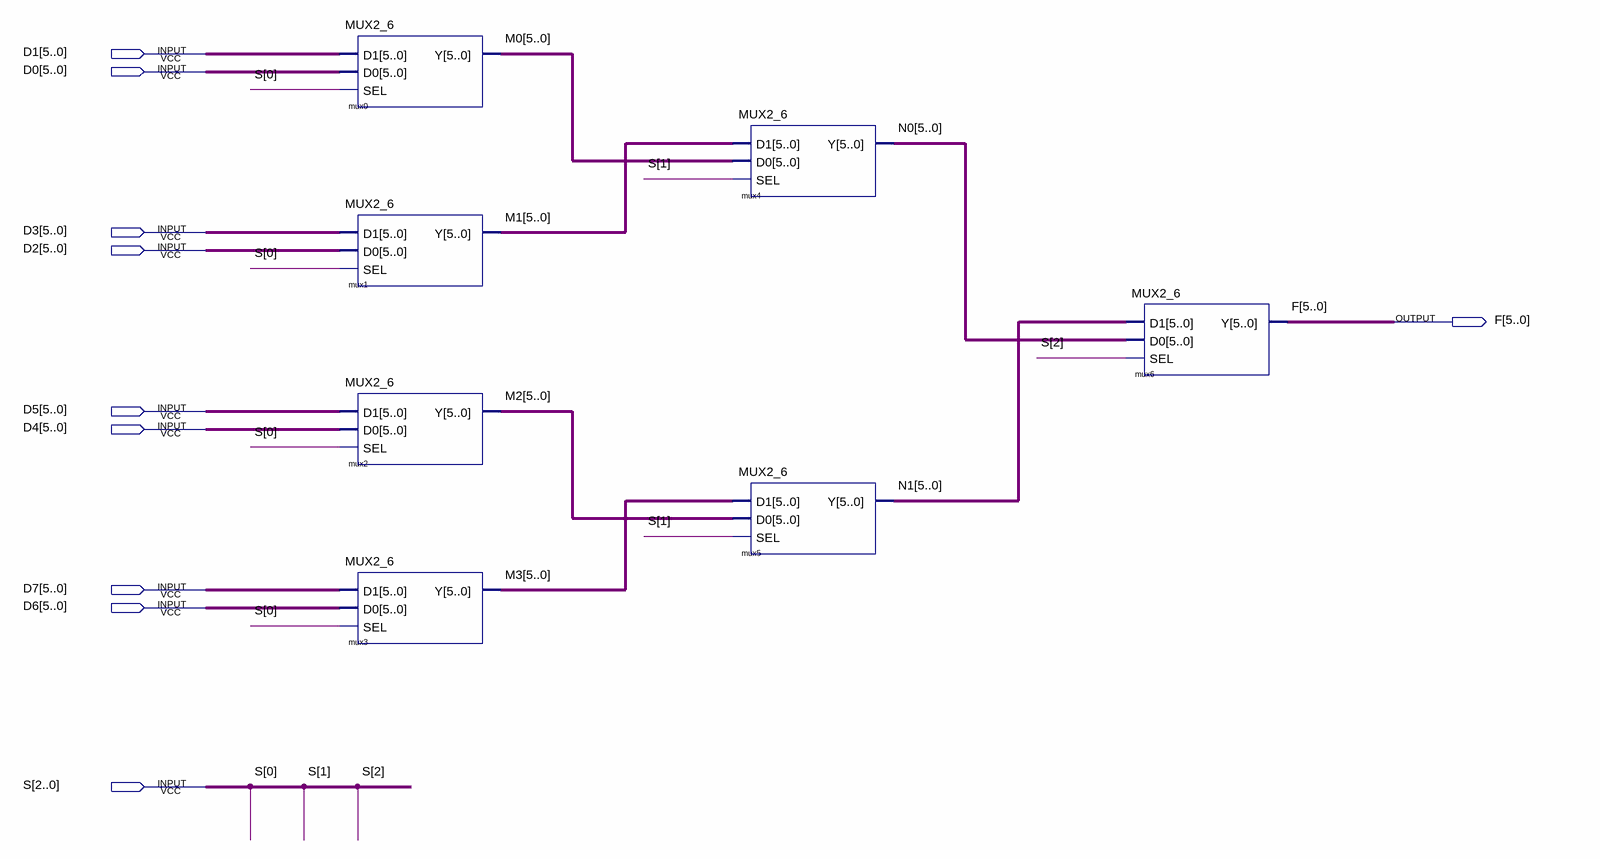
[diagram p0: schematic sheet]
// Quartus schematic MUX8_6.bdf as structural Verilog: 7 symbols, 10 pins
module MUX8_6 (
  input  [5:0] D1,
  input  [5:0] D0,
  input  [5:0] D3,
  input  [5:0] D2,
  input  [5:0] D5,
  input  [5:0] D4,
  input  [5:0] D7,
  input  [5:0] D6,
  input  [2:0] S,
  output [5:0] F
);

  wire [5:0] M0, M1, M2, M3, N0, N1;

  MUX2_6 mux0 (.D1(D1), .D0(D0), .SEL(S[0]), .Y(M0));
  MUX2_6 mux1 (.D1(D3), .D0(D2), .SEL(S[0]), .Y(M1));
  MUX2_6 mux2 (.D1(D5), .D0(D4), .SEL(S[0]), .Y(M2));
  MUX2_6 mux3 (.D1(D7), .D0(D6), .SEL(S[0]), .Y(M3));
  MUX2_6 mux4 (.D1(M1), .D0(M0), .SEL(S[1]), .Y(N0));
  MUX2_6 mux5 (.D1(M3), .D0(M2), .SEL(S[1]), .Y(N1));
  MUX2_6 mux6 (.D1(N1), .D0(N0), .SEL(S[2]), .Y(F));
endmodule
